# Altium schematic sheet Reference Schematic_2021-02-26.schdoc
size 1412 x 569 mm
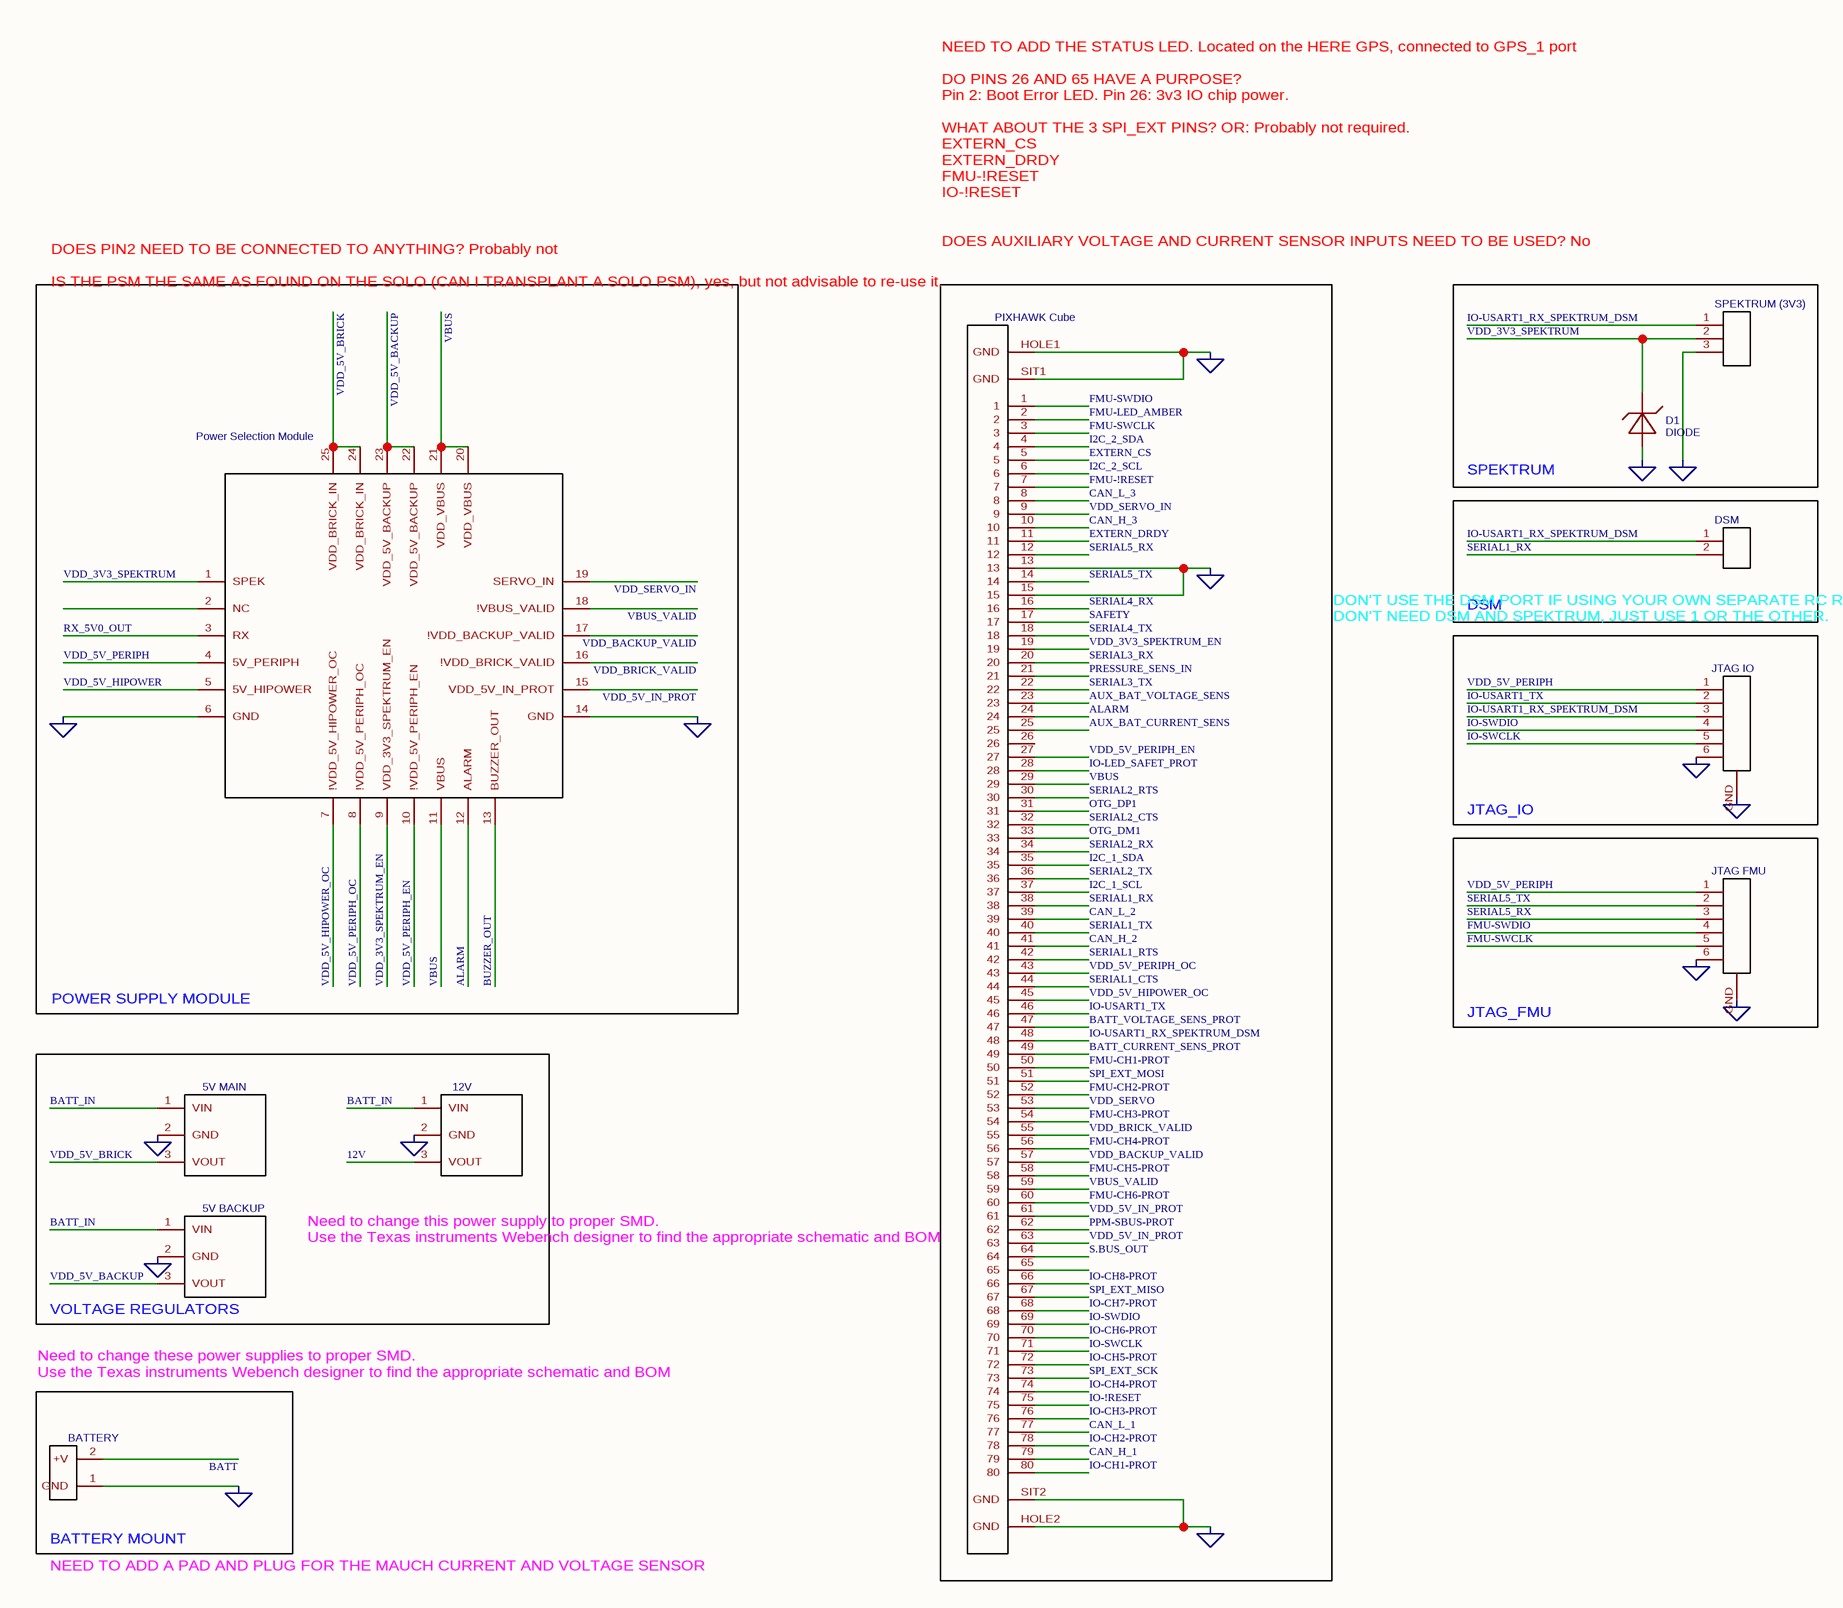
[diagram p0: Reference Schematic_2021-02-26.schdoc, top left]
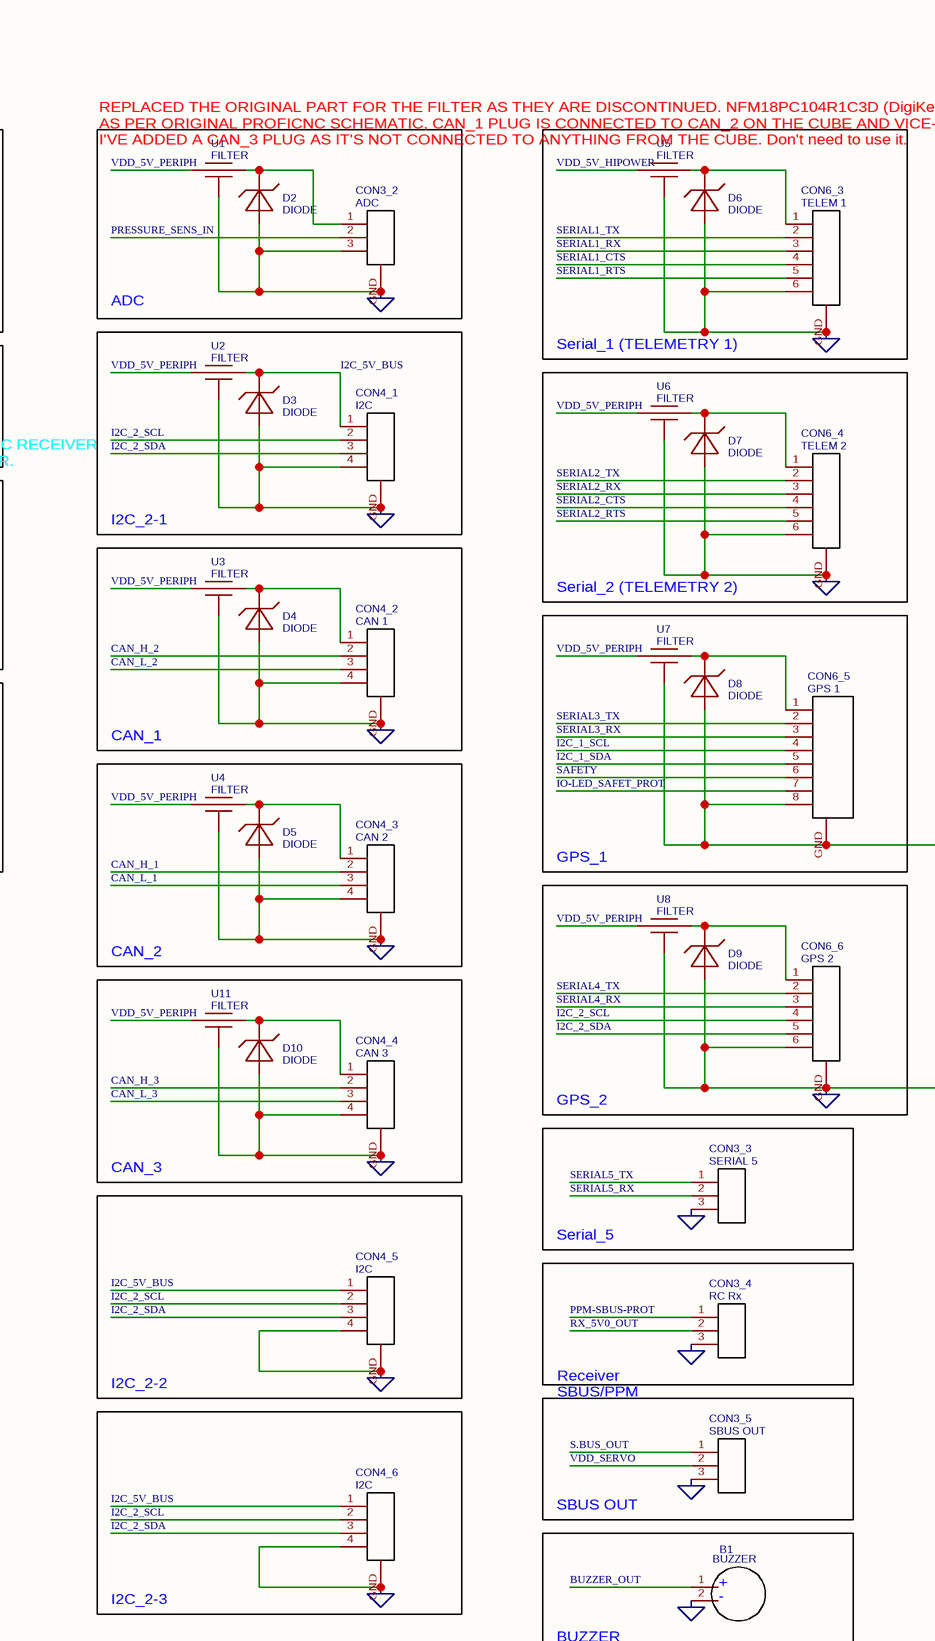
[diagram p1: Reference Schematic_2021-02-26.schdoc, top middle]
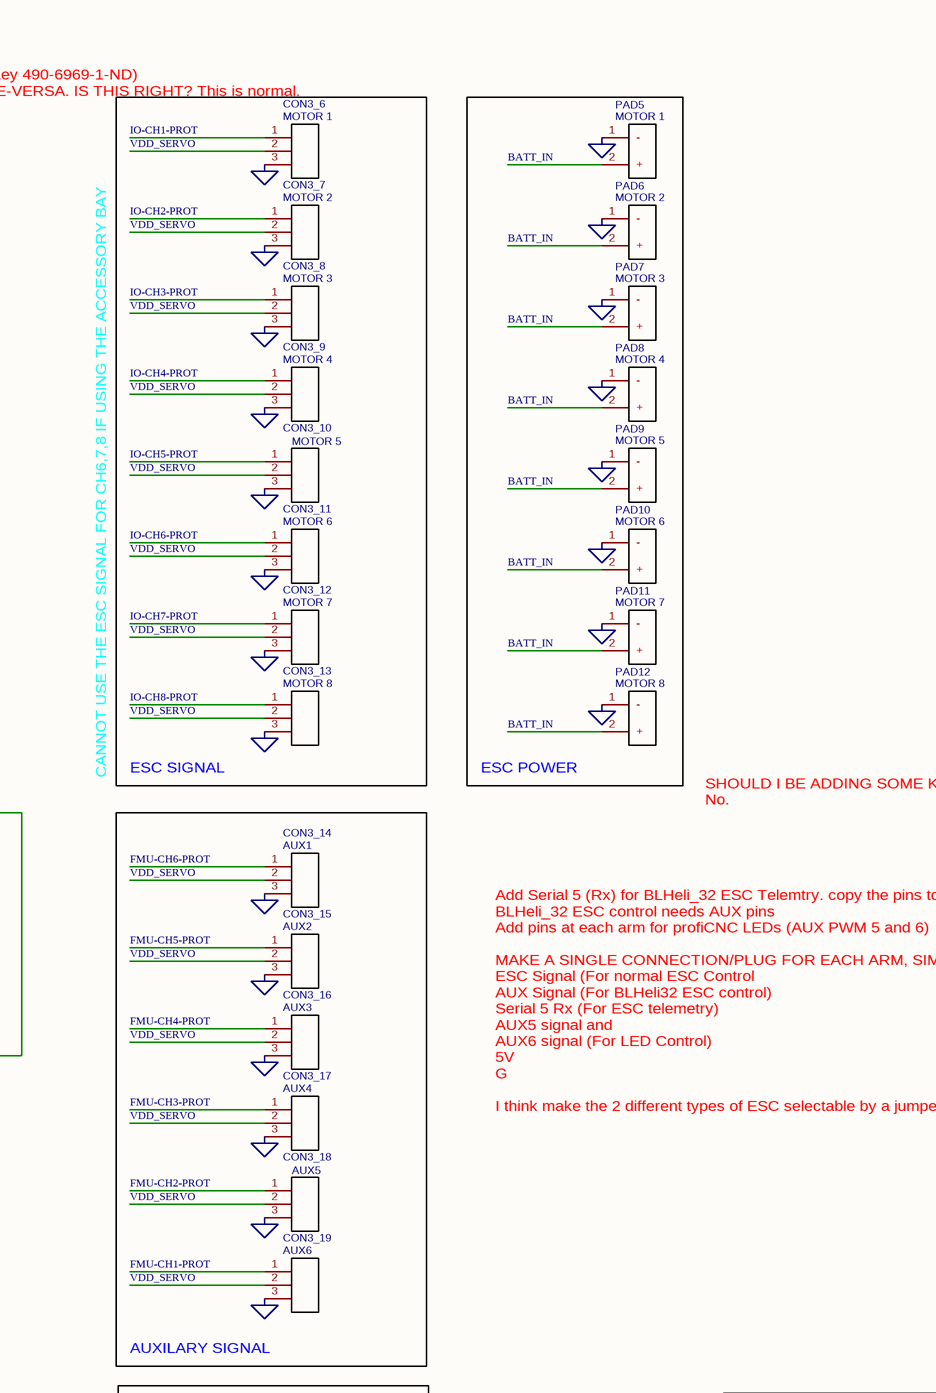
[diagram p2: Reference Schematic_2021-02-26.schdoc, top right]
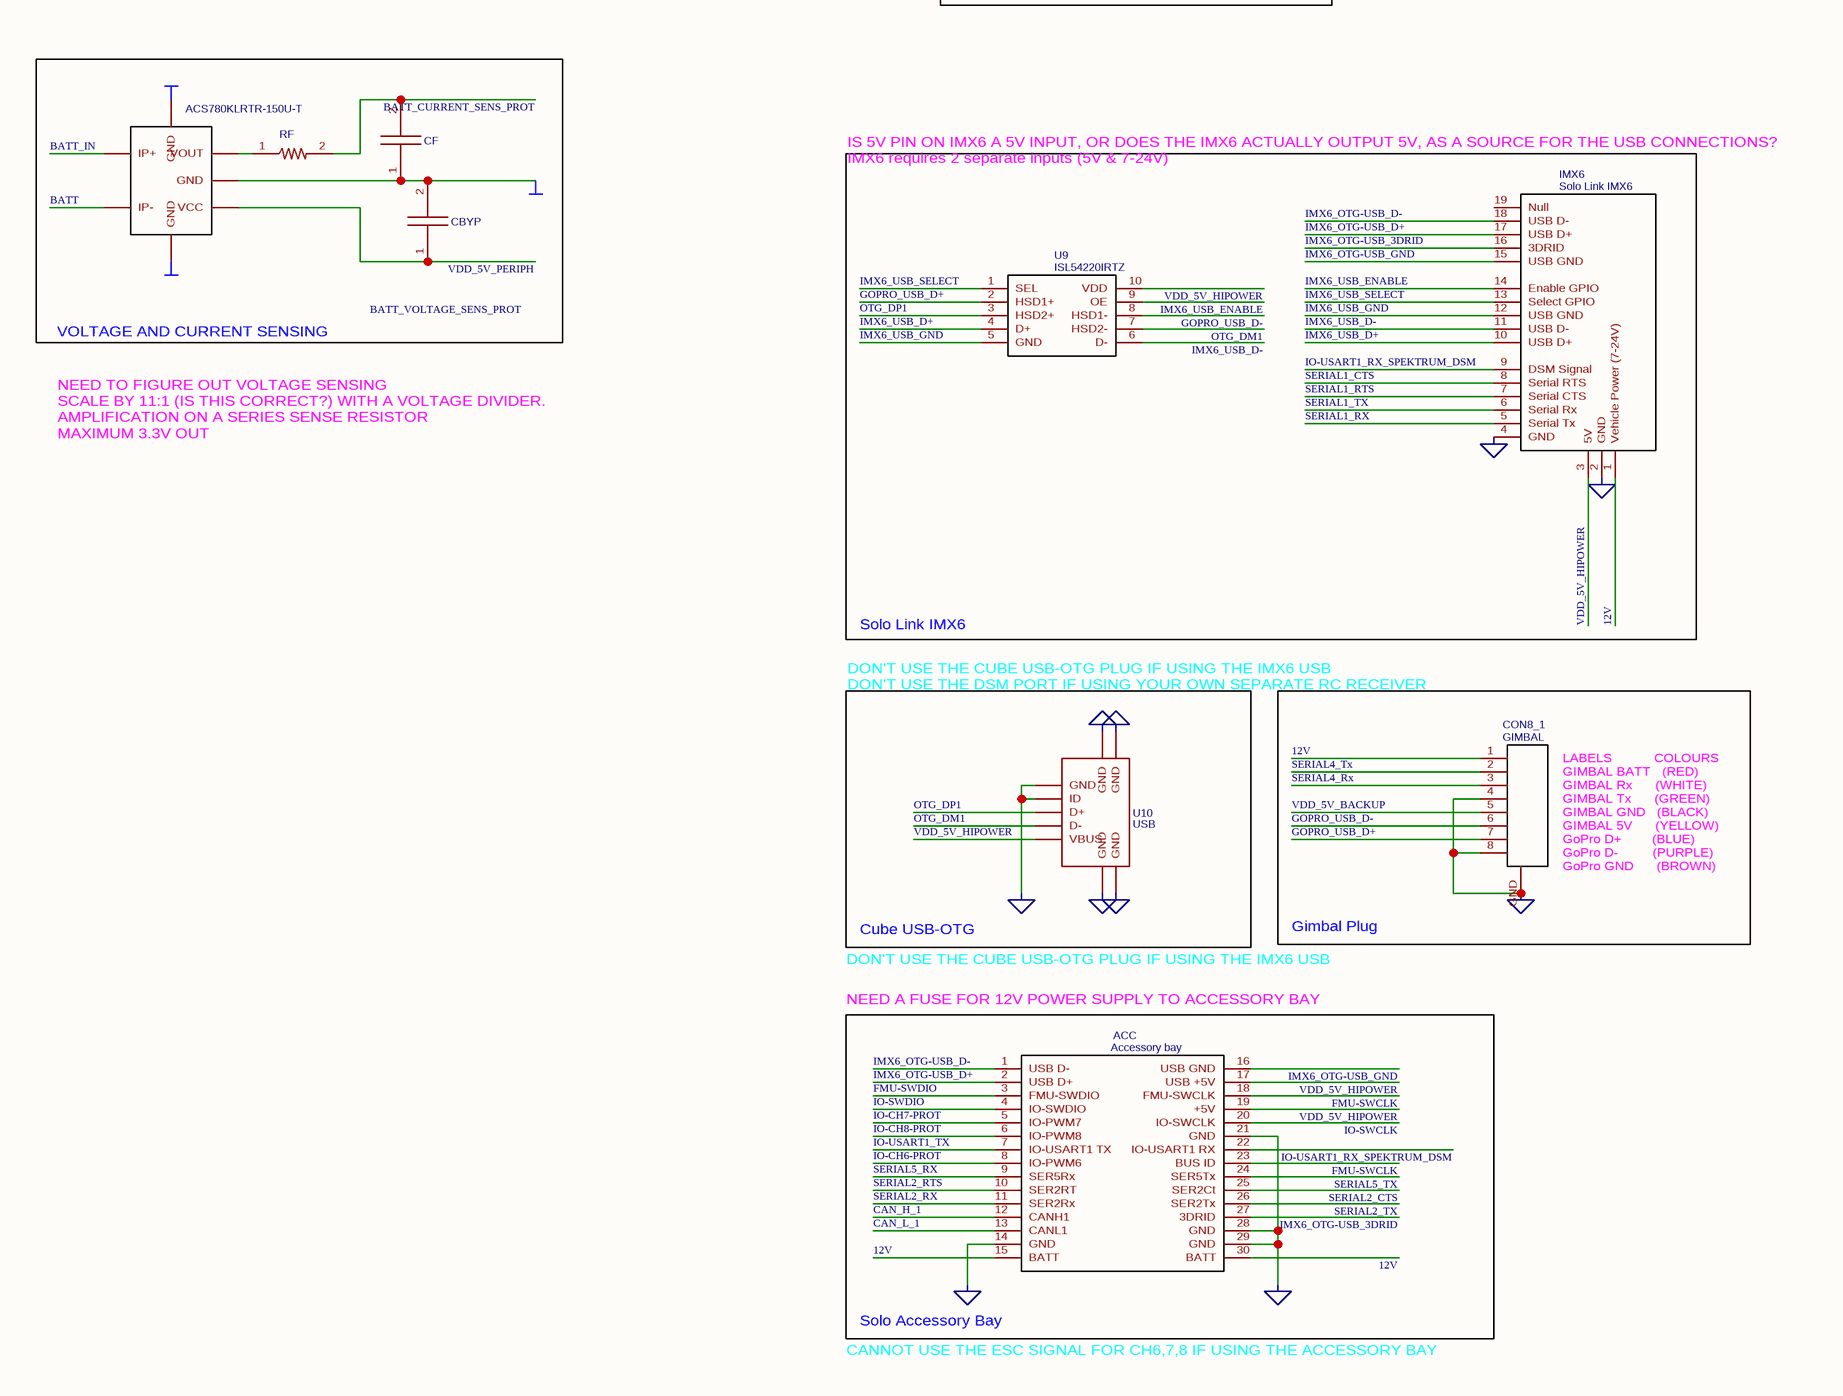
[diagram p3: Reference Schematic_2021-02-26.schdoc, bottom left]
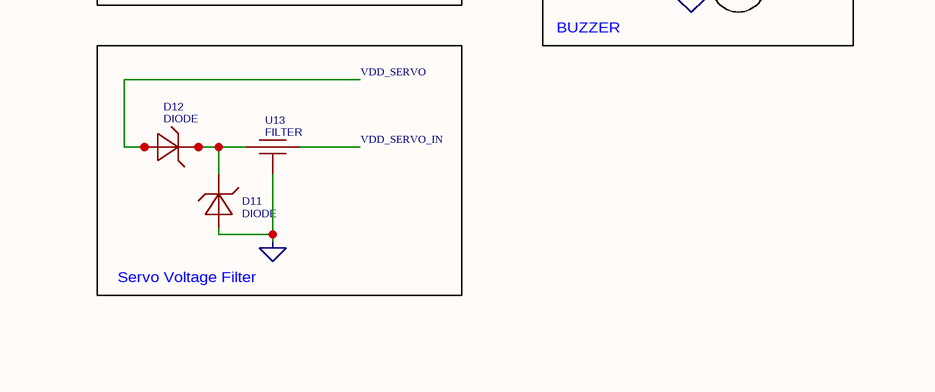
[diagram p4: Reference Schematic_2021-02-26.schdoc, bottom middle]
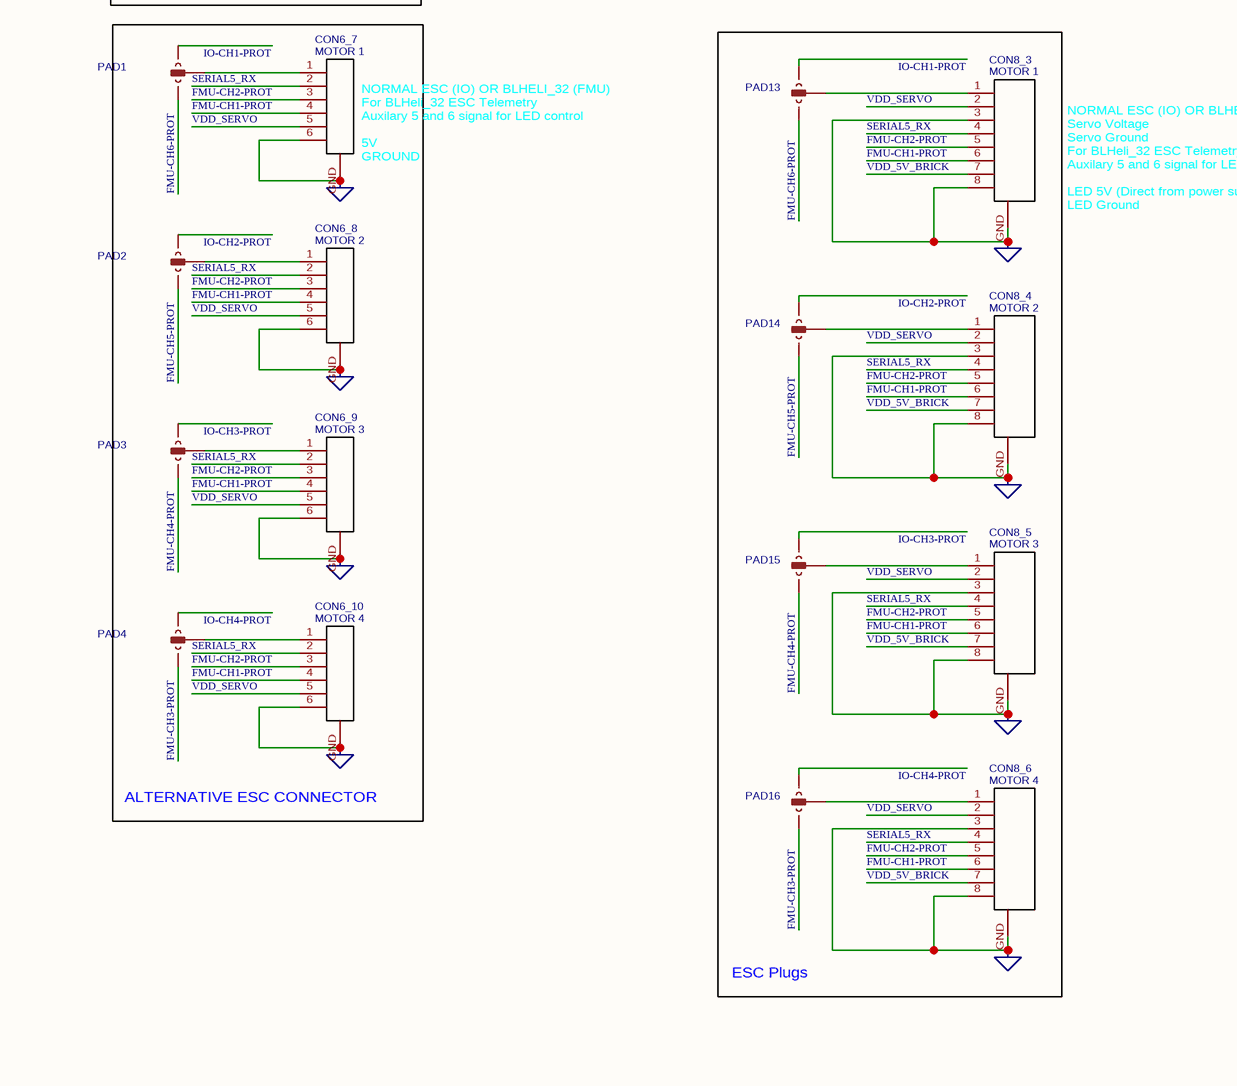
[diagram p5: Reference Schematic_2021-02-26.schdoc, bottom right]

## Parts
5V_1  5V MAIN  [D24V50F5]
5V_2  5V BACKUP  [D24V50F5]
12V_1  12V  [D24V22F12]
ACC  Accessory bay  [ACCESSORY BAY]
B1  BUZZER  [AT-2460-TWT-R]
BATTERY_PAD  BATTERY  [XT60 PANEL MOUNT]
CBYP  Capacitor  [NONE]  (value not drawn)
CF  Capacitor  [NONE]  (value not drawn)
CON2_1  DSM  [2X1 THROUGH HOLE HEADER]
CON3_1  SPEKTRUM (3V3)  [3X1 THROUGH HOLE HEADER]
CON3_2  ADC  [BM03B-GHS-TBT]
CON3_3  SERIAL 5  [3X1 THROUGH HOLE HEADER]
CON3_4  RC Rx  [3X1 SERVO HEADER]
CON3_5  SBUS OUT  [3X1 SERVO HEADER]
CON3_6  MOTOR 1  [3X1 SERVO HEADER]
CON3_7  MOTOR 2  [3X1 SERVO HEADER]
CON3_8  MOTOR 3  [3X1 SERVO HEADER]
CON3_9  MOTOR 4  [3X1 SERVO HEADER]
CON3_10  MOTOR 5  [3X1 SERVO HEADER]
CON3_11  MOTOR 6  [3X1 SERVO HEADER]
CON3_12  MOTOR 7  [3X1 SERVO HEADER]
CON3_13  MOTOR 8  [3X1 SERVO HEADER]
CON3_14  AUX1  [3X1 THROUGH HOLE HEADER]
CON3_15  AUX2  [3X1 THROUGH HOLE HEADER]
CON3_16  AUX3  [3X1 THROUGH HOLE HEADER]
CON3_17  AUX4  [3X1 THROUGH HOLE HEADER]
CON3_18  AUX5  [3X1 THROUGH HOLE HEADER]
CON3_19  AUX6  [3X1 THROUGH HOLE HEADER]
CON4_1  I2C  [BM04B-GHS-TBT]
CON4_2  CAN 1  [BM04B-GHS-TBT]
CON4_3  CAN 2  [BM04B-GHS-TBT]
CON4_4  CAN 3  [BM04B-GHS-TBT]
CON4_5  I2C  [BM04B-GHS-TBT]
CON4_6  I2C  [BM04B-GHS-TBT]
CON6_1  JTAG IO  [SM06B-SURS-TF]
CON6_2  JTAG FMU  [SM06B-SURS-TF]
CON6_3  TELEM 1  [BM06B-GHS-TBT]
CON6_4  TELEM 2  [BM06B-GHS-TBT]
CON6_5  GPS 1  [BM08B-GHS-TBT]
CON6_6  GPS 2  [BM06B-GHS-TBT]
CON6_7  MOTOR 1  [BM06B-GHS-TBT (FOR MOTOR MOUNTS)]
CON6_8  MOTOR 2  [BM06B-GHS-TBT (FOR MOTOR MOUNTS)]
CON6_9  MOTOR 3  [BM06B-GHS-TBT (FOR MOTOR MOUNTS)]
CON6_10  MOTOR 4  [BM06B-GHS-TBT (FOR MOTOR MOUNTS)]
CON8_1  GIMBAL  [BM08B-GHS-TBT]
CON8_3  MOTOR 1  [BM08B-GHS-TBT (FOR MOTOR MOUNTS)]
CON8_4  MOTOR 2  [BM08B-GHS-TBT (FOR MOTOR MOUNTS)]
CON8_5  MOTOR 3  [BM08B-GHS-TBT (FOR MOTOR MOUNTS)]
CON8_6  MOTOR 4  [BM08B-GHS-TBT (FOR MOTOR MOUNTS)]
D1  DIODE  [0402 DIODE]
D2  DIODE  [0402 DIODE]
D3  DIODE  [0402 DIODE]
D4  DIODE  [0402 DIODE]
D5  DIODE  [0402 DIODE]
D6  DIODE  [0402 DIODE]
D7  DIODE  [0402 DIODE]
D8  DIODE  [0402 DIODE]
D9  DIODE  [0402 DIODE]
D10  DIODE  [0402 DIODE]
D11  DIODE  [0402 DIODE]
D12  DIODE  [MSS1P4-M3/89A DIODE]
DF17(1.0H)-80DP-0.5V(57)  PIXHAWK Cube  [CON-DF17-80M]
IMX6  Solo Link IMX6  [SOLO LINK IMX6]
PAD1  ESC Select  [SOLDER JUMPER (ESC - BLHELI)]  (value not drawn)
PAD2  ESC Select  [SOLDER JUMPER (ESC - BLHELI)]  (value not drawn)
PAD3  ESC Select  [SOLDER JUMPER (ESC - BLHELI)]  (value not drawn)
PAD4  ESC Select  [SOLDER JUMPER (ESC - BLHELI)]  (value not drawn)
PAD5  MOTOR 1  [MOTOR PAD]
PAD6  MOTOR 2  [MOTOR PAD]
PAD7  MOTOR 3  [MOTOR PAD]
PAD8  MOTOR 4  [MOTOR PAD]
PAD9  MOTOR 5  [MOTOR PAD]
PAD10  MOTOR 6  [MOTOR PAD]
PAD11  MOTOR 7  [MOTOR PAD]
PAD12  MOTOR 8  [MOTOR PAD]
PAD13  ESC Select  [SOLDER JUMPER (ESC - BLHELI)]  (value not drawn)
PAD14  ESC Select  [SOLDER JUMPER (ESC - BLHELI)]  (value not drawn)
PAD15  ESC Select  [SOLDER JUMPER (ESC - BLHELI)]  (value not drawn)
PAD16  ESC Select  [SOLDER JUMPER (ESC - BLHELI)]  (value not drawn)
PSM  Power Selection Module  [POWER SELECTION MODULE]
RF  Resistor  [NONE]  (value not drawn)
U1  FILTER  [0603 LC EMI FILTER]
U2  FILTER  [0603 LC EMI FILTER]
U3  FILTER  [0603 LC EMI FILTER]
U4  FILTER  [0603 LC EMI FILTER]
U5  FILTER  [0603 LC EMI FILTER]
U6  FILTER  [0603 LC EMI FILTER]
U7  FILTER  [0603 LC EMI FILTER]
U8  FILTER  [0603 LC EMI FILTER]
U9  ISL54220IRTZ  [ISL54220IRTZ]
U10  USB  [10118194-0001LF]
U11  FILTER  [0603 LC EMI FILTER]
U12  ACS780KLRTR-150U-T  [ACS780KLRTR-150U-T]
U13  FILTER  [0603 LC EMI FILTER]

## Blocks framed on the sheet
POWER SUPPLY MODULE: PSM
SPEKTRUM: CON3_1 D1
ADC: CON3_2 D2 U1
Serial_1 (TELEMETRY 1): CON6_3 D6 U5
ESC SIGNAL: CON3_6-CON3_13
ESC POWER: PAD5-PAD12
DSM: CON2_1
I2C_2-1: CON4_1 D3 U2
Serial_2 (TELEMETRY 2): CON6_4 D7 U6
JTAG_IO: CON6_1
CAN_1: CON4_2 D4 U3
GPS_1: CON6_5 D8 U7
JTAG_FMU: CON6_2
CAN_2: CON4_3 D5 U4
AUXILARY SIGNAL: CON3_14-CON3_19
VOLTAGE REGULATORS: 5V_1 5V_2 12V_1
GPS_2: CON6_6 D9 U8
CAN_3: CON4_4 D10 U11
Serial_5: CON3_3
BATTERY MOUNT: BATTERY_PAD
I2C_2-2: CON4_5
SBUS OUT: CON3_5
I2C_2-3: CON4_6
ALTERNATIVE ESC CONNECTOR: CON6_7-CON6_10 PAD1-PAD4
ESC Plugs: CON8_3-CON8_6 PAD13-PAD16
VOLTAGE AND CURRENT SENSING: CBYP CF RF U12
BUZZER: B1
Solo Link IMX6: IMX6 U9
Servo Voltage Filter: D11 D12 U13
Cube USB-OTG: U10
Gimbal Plug: CON8_1

## Nets
GND: 5V_1.2(GND) 5V_2.2(GND) 12V_1.2(GND) ACC.14(GND) ACC.21(GND) ACC.28(GND) ACC.29(GND) B1.2 BATTERY_PAD.1(GND) CBYP.2 CF.1 CON3_1.3 CON3_2.3 CON3_2.GND CON3_3.3 CON3_4.3 CON3_5.3 CON3_6.3 CON3_7.3 CON3_8.3 CON3_9.3 CON3_10.3 CON3_11.3 CON3_12.3 CON3_13.3 CON3_14.3 CON3_15.3 CON3_16.3 CON3_17.3 CON3_18.3 CON3_19.3 CON4_1.4 CON4_1.GND CON4_2.4 CON4_2.GND CON4_3.4 CON4_3.GND CON4_4.4 CON4_4.GND CON4_5.4 CON4_5.GND CON4_6.4 CON4_6.GND CON6_1.6 CON6_1.GND CON6_2.6 CON6_2.GND CON6_3.6 CON6_3.GND CON6_4.6 CON6_4.GND CON6_5.8 CON6_5.GND CON6_6.6 CON6_6.GND CON6_7.6 CON6_7.GND CON6_8.6 CON6_8.GND CON6_9.6 CON6_9.GND CON6_10.6 CON6_10.GND CON8_1.4 CON8_1.8 CON8_1.GND CON8_3.3 CON8_3.8 CON8_3.GND CON8_4.3 CON8_4.8 CON8_4.GND CON8_5.3 CON8_5.8 CON8_5.GND CON8_6.3 CON8_6.8 CON8_6.GND D1.2 D2.2 D3.2 D4.2 D5.2 D6.2 D7.2 D8.2 D9.2 D10.2 D11.2 DF17(1.0H)-80DP-0.5V(57).13 DF17(1.0H)-80DP-0.5V(57).15 DF17(1.0H)-80DP-0.5V(57).HOLE1(GND) DF17(1.0H)-80DP-0.5V(57).HOLE2(GND) DF17(1.0H)-80DP-0.5V(57).SIT1(GND) DF17(1.0H)-80DP-0.5V(57).SIT2(GND) IMX6.2(GND) IMX6.4(GND) PAD5.1(-) PAD6.1(-) PAD7.1(-) PAD8.1(-) PAD9.1(-) PAD10.1(-) PAD11.1(-) PAD12.1(-) PSM.6(GND) PSM.14(GND) U1.GND U2.GND U3.GND U4.GND U5.GND U6.GND U7.GND U8.GND U10.4(ID) U10.5(GND) U10.GND U11.GND U12.2(GND) U12.4(GND) U12.7(GND) U13.GND
12V: 12V_1.3(VOUT) ACC.15(BATT) ACC.30(BATT) CON8_1.1 IMX6.1(Vehicle_Power_(7-24V))
ALARM: DF17(1.0H)-80DP-0.5V(57).24 PSM.12(ALARM)
AUX_BAT_CURRENT_SENS: DF17(1.0H)-80DP-0.5V(57).25
AUX_BAT_VOLTAGE_SENS: DF17(1.0H)-80DP-0.5V(57).23
BATT: BATTERY_PAD.2(+V) U12.6(IP-)
BATT_CURRENT_SENS_PROT: CF.2 DF17(1.0H)-80DP-0.5V(57).49 RF.2
BATT_IN: 5V_1.1(VIN) 5V_2.1(VIN) 12V_1.1(VIN) PAD5.2(+) PAD6.2(+) PAD7.2(+) PAD8.2(+) PAD9.2(+) PAD10.2(+) PAD11.2(+) PAD12.2(+) U12.5(IP+)
BATT_VOLTAGE_SENS_PROT: DF17(1.0H)-80DP-0.5V(57).47
BUZZER_OUT: B1.1 PSM.13(BUZZER_OUT)
CAN_H_1: ACC.12(CANH1) CON4_3.2 DF17(1.0H)-80DP-0.5V(57).79
CAN_H_2: CON4_2.2 DF17(1.0H)-80DP-0.5V(57).41
CAN_H_3: CON4_4.2 DF17(1.0H)-80DP-0.5V(57).10
CAN_L_1: ACC.13(CANL1) CON4_3.3 DF17(1.0H)-80DP-0.5V(57).77
CAN_L_2: CON4_2.3 DF17(1.0H)-80DP-0.5V(57).39
CAN_L_3: CON4_4.3 DF17(1.0H)-80DP-0.5V(57).8
EXTERN_CS: DF17(1.0H)-80DP-0.5V(57).5
EXTERN_DRDY: DF17(1.0H)-80DP-0.5V(57).11
FMU-!RESET: DF17(1.0H)-80DP-0.5V(57).7
FMU-CH1-PROT: CON3_19.1 CON6_7.4 CON6_8.4 CON6_9.4 CON6_10.4 CON8_3.6 CON8_4.6 CON8_5.6 CON8_6.6 DF17(1.0H)-80DP-0.5V(57).50
FMU-CH2-PROT: CON3_18.1 CON6_7.3 CON6_8.3 CON6_9.3 CON6_10.3 CON8_3.5 CON8_4.5 CON8_5.5 CON8_6.5 DF17(1.0H)-80DP-0.5V(57).52
FMU-CH3-PROT: CON3_17.1 DF17(1.0H)-80DP-0.5V(57).54 PAD4.3 PAD16.3
FMU-CH4-PROT: CON3_16.1 DF17(1.0H)-80DP-0.5V(57).56 PAD3.3 PAD15.3
FMU-CH5-PROT: CON3_15.1 DF17(1.0H)-80DP-0.5V(57).58 PAD2.3 PAD14.3
FMU-CH6-PROT: CON3_14.1 DF17(1.0H)-80DP-0.5V(57).60 PAD1.3 PAD13.3
FMU-LED_AMBER: DF17(1.0H)-80DP-0.5V(57).2
FMU-SWCLK: ACC.18(FMU-SWCLK) ACC.23(BUS_ID) CON6_2.5 DF17(1.0H)-80DP-0.5V(57).3
FMU-SWDIO: ACC.3(FMU-SWDIO) CON6_2.4 DF17(1.0H)-80DP-0.5V(57).1
GOPRO_USB_D+: CON8_1.7 U9.2(HSD1+)
GOPRO_USB_D-: CON8_1.6 U9.8(HSD1-)
I2C_1_SCL: CON6_5.4 DF17(1.0H)-80DP-0.5V(57).37
I2C_1_SDA: CON6_5.5 DF17(1.0H)-80DP-0.5V(57).35
I2C_2_SCL: CON4_1.2 CON4_5.2 CON4_6.2 CON6_6.4 DF17(1.0H)-80DP-0.5V(57).6
I2C_2_SDA: CON4_1.3 CON4_5.3 CON4_6.3 CON6_6.5 DF17(1.0H)-80DP-0.5V(57).4
I2C_5V_BUS: CON4_1.1 CON4_5.1 CON4_6.1 D3.1 U2.2
IMX6_OTG-USB_3DRID: ACC.27(3DRID) IMX6.16(3DRID)
IMX6_OTG-USB_D+: ACC.2(USB_D+) IMX6.17(USB_D+)
IMX6_OTG-USB_D-: ACC.1(USB_D-) IMX6.18(USB_D-)
IMX6_OTG-USB_GND: ACC.16(USB_GND) IMX6.15(USB_GND)
IMX6_USB_D+: IMX6.10(USB_D+) U9.4(D+)
IMX6_USB_D-: IMX6.11(USB_D-) U9.6(D-)
IMX6_USB_ENABLE: IMX6.14(Enable_GPIO) U9.9(OE)
IMX6_USB_GND: IMX6.12(USB_GND) U9.5(GND)
IMX6_USB_SELECT: IMX6.13(Select_GPIO) U9.1(SEL)
IO-!RESET: DF17(1.0H)-80DP-0.5V(57).75
IO-CH1-PROT: CON3_6.1 DF17(1.0H)-80DP-0.5V(57).80 PAD1.1 PAD13.1
IO-CH2-PROT: CON3_7.1 DF17(1.0H)-80DP-0.5V(57).78 PAD2.1 PAD14.1
IO-CH3-PROT: CON3_8.1 DF17(1.0H)-80DP-0.5V(57).76 PAD3.1 PAD15.1
IO-CH4-PROT: CON3_9.1 DF17(1.0H)-80DP-0.5V(57).74 PAD4.1 PAD16.1
IO-CH5-PROT: CON3_10.1 DF17(1.0H)-80DP-0.5V(57).72
IO-CH6-PROT: ACC.8(IO-PWM6) CON3_11.1 DF17(1.0H)-80DP-0.5V(57).70
IO-CH7-PROT: ACC.5(IO-PWM7) CON3_12.1 DF17(1.0H)-80DP-0.5V(57).68
IO-CH8-PROT: ACC.6(IO-PWM8) CON3_13.1 DF17(1.0H)-80DP-0.5V(57).66
IO-LED_SAFET_PROT: CON6_5.7 DF17(1.0H)-80DP-0.5V(57).28
IO-SWCLK: ACC.20(IO-SWCLK) CON6_1.5 DF17(1.0H)-80DP-0.5V(57).71
IO-SWDIO: ACC.4(IO-SWDIO) CON6_1.4 DF17(1.0H)-80DP-0.5V(57).69
IO-USART1_RX_SPEKTRUM_DSM: ACC.22(IO-USART1_RX) CON2_1.1 CON3_1.1 CON6_1.3 DF17(1.0H)-80DP-0.5V(57).48 IMX6.9(DSM_Signal)
IO-USART1_TX: ACC.7(IO-USART1_TX) CON6_1.2 DF17(1.0H)-80DP-0.5V(57).46
OTG_DM1: DF17(1.0H)-80DP-0.5V(57).33 U9.7(HSD2-) U10.2(D-)
OTG_DP1: DF17(1.0H)-80DP-0.5V(57).31 U9.3(HSD2+) U10.3(D+)
PPM-SBUS-PROT: CON3_4.1 DF17(1.0H)-80DP-0.5V(57).62
PRESSURE_SENS_IN: CON3_2.2 DF17(1.0H)-80DP-0.5V(57).21
RX_5V0_OUT: CON3_4.2 PSM.3(RX)
S.BUS_OUT: CON3_5.1 DF17(1.0H)-80DP-0.5V(57).64
SAFETY: CON6_5.6 DF17(1.0H)-80DP-0.5V(57).17
SERIAL1_CTS: CON6_3.4 DF17(1.0H)-80DP-0.5V(57).44 IMX6.8(Serial_RTS)
SERIAL1_RTS: CON6_3.5 DF17(1.0H)-80DP-0.5V(57).42 IMX6.7(Serial_CTS)
SERIAL1_RX: CON2_1.2 CON6_3.3 DF17(1.0H)-80DP-0.5V(57).38 IMX6.5(Serial_Tx)
SERIAL1_TX: CON6_3.2 DF17(1.0H)-80DP-0.5V(57).40 IMX6.6(Serial_Rx)
SERIAL2_CTS: ACC.25(SER2Ct) CON6_4.4 DF17(1.0H)-80DP-0.5V(57).32
SERIAL2_RTS: ACC.10(SER2RT) CON6_4.5 DF17(1.0H)-80DP-0.5V(57).30
SERIAL2_RX: ACC.11(SER2Rx) CON6_4.3 DF17(1.0H)-80DP-0.5V(57).34
SERIAL2_TX: ACC.26(SER2Tx) CON6_4.2 DF17(1.0H)-80DP-0.5V(57).36
SERIAL3_RX: CON6_5.3 DF17(1.0H)-80DP-0.5V(57).20
SERIAL3_TX: CON6_5.2 DF17(1.0H)-80DP-0.5V(57).22
SERIAL4_RX: CON6_6.3 CON8_1.3 DF17(1.0H)-80DP-0.5V(57).16
SERIAL4_TX: CON6_6.2 CON8_1.2 DF17(1.0H)-80DP-0.5V(57).18
SERIAL5_RX: ACC.9(SER5Rx) CON3_3.2 CON6_2.3 CON6_7.2 CON6_8.2 CON6_9.2 CON6_10.2 CON8_3.4 CON8_4.4 CON8_5.4 CON8_6.4 DF17(1.0H)-80DP-0.5V(57).12
SERIAL5_TX: ACC.24(SER5Tx) CON3_3.1 CON6_2.2 DF17(1.0H)-80DP-0.5V(57).14
SPI_EXT_MISO: DF17(1.0H)-80DP-0.5V(57).67
SPI_EXT_MOSI: DF17(1.0H)-80DP-0.5V(57).51
SPI_EXT_SCK: DF17(1.0H)-80DP-0.5V(57).73
VBUS: DF17(1.0H)-80DP-0.5V(57).29 PSM.11(VBUS) PSM.20(VDD_VBUS) PSM.21(VDD_VBUS)
VBUS_VALID: DF17(1.0H)-80DP-0.5V(57).59 PSM.18(!VBUS_VALID)
VDD_3V3_SPEKTRUM: CON3_1.2 D1.1 PSM.1(SPEK)
VDD_3V3_SPEKTRUM_EN: DF17(1.0H)-80DP-0.5V(57).19 PSM.9(VDD_3V3_SPEKTRUM_EN)
VDD_5V_BACKUP: 5V_2.3(VOUT) CON8_1.5 PSM.22(VDD_5V_BACKUP) PSM.23(VDD_5V_BACKUP)
VDD_5V_BRICK: 5V_1.3(VOUT) CON8_3.7 CON8_4.7 CON8_5.7 CON8_6.7 PSM.24(VDD_BRICK_IN) PSM.25(VDD_BRICK_IN)
VDD_5V_HIPOWER: ACC.17(USB_+5V) ACC.19(+5V) IMX6.3(5V) PSM.5(5V_HIPOWER) U5.1 U9.10(VDD) U10.1(VBUS)
VDD_5V_HIPOWER_OC: DF17(1.0H)-80DP-0.5V(57).45 PSM.7(!VDD_5V_HIPOWER_OC)
VDD_5V_IN_PROT: DF17(1.0H)-80DP-0.5V(57).61 DF17(1.0H)-80DP-0.5V(57).63 PSM.15(VDD_5V_IN_PROT)
VDD_5V_PERIPH: CBYP.1 CON6_1.1 CON6_2.1 PSM.4(5V_PERIPH) U1.1 U2.1 U3.1 U4.1 U6.1 U7.1 U8.1 U11.1 U12.1(VCC)
VDD_5V_PERIPH_EN: DF17(1.0H)-80DP-0.5V(57).27 PSM.10(!VDD_5V_PERIPH_EN)
VDD_5V_PERIPH_OC: DF17(1.0H)-80DP-0.5V(57).43 PSM.8(!VDD_5V_PERIPH_OC)
VDD_BACKUP_VALID: DF17(1.0H)-80DP-0.5V(57).57 PSM.17(!VDD_BACKUP_VALID)
VDD_BRICK_VALID: DF17(1.0H)-80DP-0.5V(57).55 PSM.16(!VDD_BRICK_VALID)
VDD_SERVO: CON3_5.2 CON3_6.2 CON3_7.2 CON3_8.2 CON3_9.2 CON3_10.2 CON3_11.2 CON3_12.2 CON3_13.2 CON3_14.2 CON3_15.2 CON3_16.2 CON3_17.2 CON3_18.2 CON3_19.2 CON6_7.5 CON6_8.5 CON6_9.5 CON6_10.5 CON8_3.2 CON8_4.2 CON8_5.2 CON8_6.2 D12.2 DF17(1.0H)-80DP-0.5V(57).53
VDD_SERVO_IN: DF17(1.0H)-80DP-0.5V(57).9 PSM.19(SERVO_IN) U13.2
NetCON3_2_1: CON3_2.1 D2.1 U1.2
NetCON4_2_1: CON4_2.1 D4.1 U3.2
NetCON4_3_1: CON4_3.1 D5.1 U4.2
NetCON4_4_1: CON4_4.1 D10.1 U11.2
NetCON6_3_1: CON6_3.1 D6.1 U5.2
NetCON6_4_1: CON6_4.1 D7.1 U6.2
NetCON6_5_1: CON6_5.1 D8.1 U7.2
NetCON6_6_1: CON6_6.1 D9.1 U8.2
NetCON6_7_1: CON6_7.1 PAD1.2
NetCON6_8_1: CON6_8.1 PAD2.2
NetCON6_9_1: CON6_9.1 PAD3.2
NetCON6_10_1: CON6_10.1 PAD4.2
NetCON8_3_1: CON8_3.1 PAD13.2
NetCON8_4_1: CON8_4.1 PAD14.2
NetCON8_5_1: CON8_5.1 PAD15.2
NetCON8_6_1: CON8_6.1 PAD16.2
NetD11_1: D11.1 D12.1 U13.1
NetRF_1: RF.1 U12.3(VOUT)

Not connected (* = marked no-connect by the designer): DF17(1.0H)-80DP-0.5V(57) 26 65; IMX6 19(Null); PSM 2(NC)

## Notes on the sheet
- NEED TO ADD THE STATUS LED. Located on the HERE GPS, connected to GPS_1 port
  DO PINS 26 AND 65 HAVE A PURPOSE?
  Pin 2: Boot Error LED. Pin 26: 3v3 IO chip power.
  WHAT ABOUT THE 3 SPI_EXT PINS? OR: Probably not required.
  EXTERN_CS
  EXTERN_DRDY
  FMU-!RESET
  IO-!RESET
  DOES AUXILIARY VOLTAGE AND CURRENT SENSOR INPUTS NEED TO BE USED? No
- DOES PIN2 NEED TO BE CONNECTED TO ANYTHING? Probably not
  IS THE PSM THE SAME AS FOUND ON THE SOLO (CAN I TRANSPLANT A SOLO PSM), yes, but not advisable to re-use it.
- (near U1) REPLACED THE ORIGINAL PART FOR THE FILTER AS THEY ARE DISCONTINUED. NFM18PC104R1C3D (DigiKey 490-6969-1-ND)
  AS PER ORIGINAL PROFICNC SCHEMATIC, CAN_1 PLUG IS CONNECTED TO CAN_2 ON THE CUBE AND VICE-VERSA. IS THIS RIGHT? This is normal.
  I'VE ADDED A CAN_3 PLUG AS IT'S NOT CONNECTED TO ANYTHING FROM THE CUBE. Don't need to use it.
- DON'T USE THE DSM PORT IF USING YOUR OWN SEPARATE RC RECEIVER
  DON'T NEED DSM AND SPEKTRUM, JUST USE 1 OR THE OTHER.
- CANNOT USE THE ESC SIGNAL FOR CH6,7,8 IF USING THE ACCESSORY BAY
- SHOULD I BE ADDING SOME KIND OF FILTER TO THE ESC SOLDER PADS?
  No.
- Add Serial 5 (Rx) for BLHeli_32 ESC Telemtry. copy the pins to each arm.
  BLHeli_32 ESC control needs AUX pins
  Add pins at each arm for profiCNC LEDs (AUX PWM 5 and 6)
  MAKE A SINGLE CONNECTION/PLUG FOR EACH ARM, SIMILAR TO THE WAY SOLO DOES IT. INCLUDE:
  ESC Signal (For normal ESC Control
  AUX Signal (For BLHeli32 ESC control)
  Serial 5 Rx (For ESC telemetry)
  AUX5 signal and
  AUX6 signal (For LED Control)
  5V
  G
  I think make the 2 different types of ESC selectable by a jumper, right near the plug
- (near 12V_1) Need to change this power supply to proper SMD.
  Use the Texas instruments Webench designer to find the appropriate schematic and BOM
- (near BATTERY_PAD) Need to change these power supplies to proper SMD.
  Use the Texas instruments Webench designer to find the appropriate schematic and BOM
- Receiver
  SBUS/PPM
- NEED TO ADD A PAD AND PLUG FOR THE MAUCH CURRENT AND VOLTAGE SENSOR
- (near CON6_7) NORMAL ESC (IO) OR BLHELI_32 (FMU)
  For BLHeli_32 ESC Telemetry
  Auxilary 5 and 6 signal for LED control
  5V
  GROUND
- NORMAL ESC (IO) OR BLHELI_32 (FMU)
  Servo Voltage
  Servo Ground
  For BLHeli_32 ESC Telemetry
  Auxilary 5 and 6 signal for LED control
  LED 5V (Direct from power supply)
  LED Ground
- (near U9) IS 5V PIN ON IMX6 A 5V INPUT, OR DOES THE IMX6 ACTUALLY OUTPUT 5V, AS A SOURCE FOR THE USB CONNECTIONS?
  IMX6 requires 2 separate inputs (5V & 7-24V)
- NEED TO FIGURE OUT VOLTAGE SENSING
  SCALE BY 11:1 (IS THIS CORRECT?) WITH A VOLTAGE DIVIDER.
  AMPLIFICATION ON A SERIES SENSE RESISTOR
  MAXIMUM 3.3V OUT
- DON'T USE THE CUBE USB-OTG PLUG IF USING THE IMX6 USB
  DON'T USE THE DSM PORT IF USING YOUR OWN SEPARATE RC RECEIVER
- (near CON8_1) LABELS           COLOURS
  GIMBAL BATT   (RED)
  GIMBAL Rx      (WHITE)
  GIMBAL Tx      (GREEN)
  GIMBAL GND   (BLACK)
  GIMBAL 5V      (YELLOW)
  GoPro D+        (BLUE)
  GoPro D-         (PURPLE)
  GoPro GND      (BROWN)
- DON'T USE THE CUBE USB-OTG PLUG IF USING THE IMX6 USB
- NEED A FUSE FOR 12V POWER SUPPLY TO ACCESSORY BAY
- Solo Accessory Bay
- Labels drawn without touching a wire or pin: BATT_VOLTAGE_SENS_PROT
- (in symbol BUZZER) +; -

## Library data of the parts
5V_1 = 5V MAIN: Contributor: geekness; BOM_Mounted: No; BOM_Manufacturer Part: D24V50F5; BOM_Supplier: Pololu; Link: https://www.pololu.com/product/2858; spicePre: U; BOM_Supplier Part: D24V50F5
5V_2 = 5V BACKUP: Contributor: geekness; BOM_Mounted: No; BOM_Manufacturer Part: D24V50F5; BOM_Supplier: Pololu; Link: https://www.pololu.com/product/2858; spicePre: U; BOM_Supplier Part: D24V50F5
12V_1 = 12V: Contributor: geekness; BOM_Mounted: No; BOM_Manufacturer Part: D24V22F12; BOM_Supplier: Pololu; Link: https://www.pololu.com/product/2855; spicePre: 1; BOM_Supplier Part: D24V22F12
ACC = Accessory bay: Contributor: geekness; BOM_Mounted: No; BOM_Manufacturer Part: ?; spicePre: A
B1 = BUZZER: Contributor: geekness; BOM_Manufacturer Part: AT-2460-TWT-R; BOM_Supplier: Digi-Key; Link: http://www.precidip.com/AppHost/9696,1/Scripts/Modules/Catalog/Default.aspx?c=73&i=444&p=167&pdf=1&dsku=892-PP-NNN-10-XXX101; spicePre: H; BOM_Supplier Part: 668-1318-ND
BATTERY_PAD = BATTERY: Contributor: geekness; BOM_Mounted: No; BOM_Manufacturer Part: XT60 Panel Mount; spicePre: U
CBYP CF = Capacitor: BOM_Manufacturer Part: New SchematicLib; Contributor: geekness; BOM_Supplier: Digi-Key; spicePre: C; BOM_Supplier Part: undefined
CON2_1 = DSM: BOM_Manufacturer Part: 892-70-012-10-001101; Contributor: geekness; BOM_Supplier: Digi-Key; Link: http://www.precidip.com/AppHost/9696,1/Scripts/Modules/Catalog/Default.aspx?c=73&i=444&p=167&pdf=1&dsku=892-PP-NNN-10-XXX101; spicePre: H; BOM_Supplier Part: 892-70-012-10-001101-ND
CON3_1 = SPEKTRUM (3V3): BOM_Manufacturer Part: 894-70-012-10-001101; Contributor: geekness; BOM_Supplier: Digi-Key; link: http://www.precidip.com/AppHost/9696,1/Scripts/Modules/Catalog/Default.aspx?c=73&i=450&p=168&pdf=1&dsku=894-PP-NNN-10-001101; spicePre: H; BOM_Supplier Part: 894-70-012-10-001101-ND
CON3_2 = ADC: BOM_Manufacturer Part: BM03B-GHS-TBT(LF)(SN)(N); catid: 20; sourceId: i5d7pHZhZ; Description: CONN HEADER GH TOP 3POS 1.25MM; timeStamp: 1458998603; BOM_Supplier: Digi-Key; Link: http://www.jst-mfg.com/product/pdf/eng/eGH.pdf; spicePre: J; BOM_Supplier Part: 455-1579-2-ND
CON3_3 = SERIAL 5: BOM_Manufacturer Part: 894-70-012-10-001101; Contributor: geekness; BOM_Mounted: No; BOM_Supplier: Digi-Key; link: http://www.precidip.com/AppHost/9696,1/Scripts/Modules/Catalog/Default.aspx?c=73&i=450&p=168&pdf=1&dsku=894-PP-NNN-10-001101; spicePre: H; BOM_Supplier Part: 894-70-012-10-001101-ND
CON3_4 = RC Rx: BOM_Manufacturer Part: 894-70-012-10-001101; Contributor: geekness; BOM_Mounted: No; BOM_Supplier: Digi-Key; link: http://www.precidip.com/AppHost/9696,1/Scripts/Modules/Catalog/Default.aspx?c=73&i=450&p=168&pdf=1&dsku=894-PP-NNN-10-001101; spicePre: H; BOM_Supplier Part: 894-70-012-10-001101-ND
CON3_5 = SBUS OUT: BOM_Manufacturer Part: 894-70-012-10-001101; Contributor: geekness; BOM_Mounted: No; BOM_Supplier: Digi-Key; link: http://www.precidip.com/AppHost/9696,1/Scripts/Modules/Catalog/Default.aspx?c=73&i=450&p=168&pdf=1&dsku=894-PP-NNN-10-001101; spicePre: H; BOM_Supplier Part: 894-70-012-10-001101-ND
CON3_6 = MOTOR 1: BOM_Manufacturer Part: 894-70-012-10-001101; Contributor: geekness; BOM_Mounted: No; BOM_Supplier: Digi-Key; link: http://www.precidip.com/AppHost/9696,1/Scripts/Modules/Catalog/Default.aspx?c=73&i=450&p=168&pdf=1&dsku=894-PP-NNN-10-001101; spicePre: H; BOM_Supplier Part: 894-70-012-10-001101-ND
CON3_7 = MOTOR 2: BOM_Manufacturer Part: 894-70-012-10-001101; Contributor: geekness; BOM_Mounted: No; BOM_Supplier: Digi-Key; link: http://www.precidip.com/AppHost/9696,1/Scripts/Modules/Catalog/Default.aspx?c=73&i=450&p=168&pdf=1&dsku=894-PP-NNN-10-001101; spicePre: H; BOM_Supplier Part: 894-70-012-10-001101-ND
CON3_8 = MOTOR 3: BOM_Manufacturer Part: 894-70-012-10-001101; Contributor: geekness; BOM_Mounted: No; BOM_Supplier: Digi-Key; link: http://www.precidip.com/AppHost/9696,1/Scripts/Modules/Catalog/Default.aspx?c=73&i=450&p=168&pdf=1&dsku=894-PP-NNN-10-001101; spicePre: H; BOM_Supplier Part: 894-70-012-10-001101-ND
CON3_9 = MOTOR 4: BOM_Manufacturer Part: 894-70-012-10-001101; Contributor: geekness; BOM_Mounted: No; BOM_Supplier: Digi-Key; link: http://www.precidip.com/AppHost/9696,1/Scripts/Modules/Catalog/Default.aspx?c=73&i=450&p=168&pdf=1&dsku=894-PP-NNN-10-001101; spicePre: H; BOM_Supplier Part: 894-70-012-10-001101-ND
CON3_10 = MOTOR 5: BOM_Manufacturer Part: 894-70-012-10-001101; Contributor: geekness; BOM_Mounted: No; BOM_Supplier: Digi-Key; link: http://www.precidip.com/AppHost/9696,1/Scripts/Modules/Catalog/Default.aspx?c=73&i=450&p=168&pdf=1&dsku=894-PP-NNN-10-001101; spicePre: H; BOM_Supplier Part: 894-70-012-10-001101-ND
CON3_11 = MOTOR 6: BOM_Manufacturer Part: 894-70-012-10-001101; Contributor: geekness; BOM_Mounted: No; BOM_Supplier: Digi-Key; link: http://www.precidip.com/AppHost/9696,1/Scripts/Modules/Catalog/Default.aspx?c=73&i=450&p=168&pdf=1&dsku=894-PP-NNN-10-001101; spicePre: H; BOM_Supplier Part: 894-70-012-10-001101-ND
CON3_12 = MOTOR 7: BOM_Manufacturer Part: 894-70-012-10-001101; Contributor: geekness; BOM_Mounted: No; BOM_Supplier: Digi-Key; link: http://www.precidip.com/AppHost/9696,1/Scripts/Modules/Catalog/Default.aspx?c=73&i=450&p=168&pdf=1&dsku=894-PP-NNN-10-001101; spicePre: H; BOM_Supplier Part: 894-70-012-10-001101-ND
CON3_13 = MOTOR 8: BOM_Manufacturer Part: 894-70-012-10-001101; Contributor: geekness; BOM_Mounted: No; BOM_Supplier: Digi-Key; link: http://www.precidip.com/AppHost/9696,1/Scripts/Modules/Catalog/Default.aspx?c=73&i=450&p=168&pdf=1&dsku=894-PP-NNN-10-001101; spicePre: H; BOM_Supplier Part: 894-70-012-10-001101-ND
CON3_14 = AUX1: BOM_Manufacturer Part: 894-70-012-10-001101; Contributor: geekness; BOM_Mounted: No; BOM_Supplier: Digi-Key; link: http://www.precidip.com/AppHost/9696,1/Scripts/Modules/Catalog/Default.aspx?c=73&i=450&p=168&pdf=1&dsku=894-PP-NNN-10-001101; spicePre: H; BOM_Supplier Part: 894-70-012-10-001101-ND
CON3_15 = AUX2: BOM_Manufacturer Part: 894-70-012-10-001101; Contributor: geekness; BOM_Mounted: No; BOM_Supplier: Digi-Key; link: http://www.precidip.com/AppHost/9696,1/Scripts/Modules/Catalog/Default.aspx?c=73&i=450&p=168&pdf=1&dsku=894-PP-NNN-10-001101; spicePre: H; BOM_Supplier Part: 894-70-012-10-001101-ND
CON3_16 = AUX3: BOM_Manufacturer Part: 894-70-012-10-001101; Contributor: geekness; BOM_Mounted: No; BOM_Supplier: Digi-Key; link: http://www.precidip.com/AppHost/9696,1/Scripts/Modules/Catalog/Default.aspx?c=73&i=450&p=168&pdf=1&dsku=894-PP-NNN-10-001101; spicePre: H; BOM_Supplier Part: 894-70-012-10-001101-ND
CON3_17 = AUX4: BOM_Manufacturer Part: 894-70-012-10-001101; Contributor: geekness; BOM_Mounted: No; BOM_Supplier: Digi-Key; link: http://www.precidip.com/AppHost/9696,1/Scripts/Modules/Catalog/Default.aspx?c=73&i=450&p=168&pdf=1&dsku=894-PP-NNN-10-001101; spicePre: H; BOM_Supplier Part: 894-70-012-10-001101-ND
CON3_18 = AUX5: BOM_Manufacturer Part: 894-70-012-10-001101; Contributor: geekness; BOM_Mounted: No; BOM_Supplier: Digi-Key; link: http://www.precidip.com/AppHost/9696,1/Scripts/Modules/Catalog/Default.aspx?c=73&i=450&p=168&pdf=1&dsku=894-PP-NNN-10-001101; spicePre: H; BOM_Supplier Part: 894-70-012-10-001101-ND
CON3_19 = AUX6: BOM_Manufacturer Part: 894-70-012-10-001101; Contributor: geekness; BOM_Mounted: No; BOM_Supplier: Digi-Key; link: http://www.precidip.com/AppHost/9696,1/Scripts/Modules/Catalog/Default.aspx?c=73&i=450&p=168&pdf=1&dsku=894-PP-NNN-10-001101; spicePre: H; BOM_Supplier Part: 894-70-012-10-001101-ND
CON4_1 CON4_5 CON4_6 = I2C: BOM_Manufacturer Part: BM04B-GHS-TBT(LF)(SN)(N); catid: 20; sourceId: i5d7pHZhZ; Description: CONN HEADER GH TOP 4POS 1.25MM; timeStamp: 1458998603; BOM_Supplier: Digi-Key; Link: http://www.jst-mfg.com/product/pdf/eng/eGH.pdf; spicePre: J; BOM_Supplier Part: 455-1580-2-ND
CON4_2 = CAN 1: BOM_Manufacturer Part: BM04B-GHS-TBT(LF)(SN)(N); catid: 20; sourceId: i5d7pHZhZ; Description: CONN HEADER GH TOP 4POS 1.25MM; timeStamp: 1458998603; BOM_Supplier: Digi-Key; Link: http://www.jst-mfg.com/product/pdf/eng/eGH.pdf; spicePre: J; BOM_Supplier Part: 455-1580-2-ND
CON4_3 = CAN 2: BOM_Manufacturer Part: BM04B-GHS-TBT(LF)(SN)(N); catid: 20; sourceId: i5d7pHZhZ; Description: CONN HEADER GH TOP 4POS 1.25MM; timeStamp: 1458998603; BOM_Supplier: Digi-Key; Link: http://www.jst-mfg.com/product/pdf/eng/eGH.pdf; spicePre: J; BOM_Supplier Part: 455-1580-2-ND
CON4_4 = CAN 3: BOM_Manufacturer Part: BM04B-GHS-TBT(LF)(SN)(N); catid: 20; sourceId: i5d7pHZhZ; Description: CONN HEADER GH TOP 4POS 1.25MM; timeStamp: 1458998603; BOM_Supplier: Digi-Key; Link: http://www.jst-mfg.com/product/pdf/eng/eGH.pdf; spicePre: J; BOM_Supplier Part: 455-1580-2-ND
CON6_1 = JTAG IO: BOM_Manufacturer Part: SM06B-SURS-TF(LF)(SN); catid: 20; sourceId: i5d7pHZhZ; Description: CONN HEADER SUR 6POS .8MM IDC; timeStamp: 1458998603; BOM_Supplier: Digi-Key; Link: http://www.jst-mfg.com/product/pdf/eng/eSUR.pdf; spicePre: J; BOM_Supplier Part: SM06B-SURS-TF(LF)(SN)-ND
CON6_2 = JTAG FMU: BOM_Manufacturer Part: SM06B-SURS-TF(LF)(SN); catid: 20; sourceId: i5d7pHZhZ; Description: CONN HEADER SUR 6POS .8MM IDC; timeStamp: 1458998603; BOM_Supplier: Digi-Key; Link: http://www.jst-mfg.com/product/pdf/eng/eSUR.pdf; spicePre: J; BOM_Supplier Part: SM06B-SURS-TF(LF)(SN)-ND
CON6_3 = TELEM 1: BOM_Manufacturer Part: BM06B-GHS-TBT(LF)(SN)(N); catid: 20; sourceId: i5d7pHZhZ; Description: CONN HEADER GH TOP 6POS 1.25MM; timeStamp: 1458998603; BOM_Supplier: Digi-Key; Link: http://www.jst-mfg.com/product/pdf/eng/eGH.pdf; spicePre: J; BOM_Supplier Part: 455-1582-2-ND
CON6_4 = TELEM 2: BOM_Manufacturer Part: BM06B-GHS-TBT(LF)(SN)(N); catid: 20; sourceId: i5d7pHZhZ; Description: CONN HEADER GH TOP 6POS 1.25MM; timeStamp: 1458998603; BOM_Supplier: Digi-Key; Link: http://www.jst-mfg.com/product/pdf/eng/eGH.pdf; spicePre: J; BOM_Supplier Part: 455-1582-2-ND
CON6_5 = GPS 1: BOM_Manufacturer Part: BM08B-GHS-TBT(LF)(SN)(N); catid: 20; sourceId: i5d7pHZhZ; Description: CONN HEADER GH TOP 8POS 1.25MM; timeStamp: 1458998603; BOM_Supplier: Digi-Key; Link: http://www.jst-mfg.com/product/pdf/eng/eGH.pdf; spicePre: J; BOM_Supplier Part: 455-1584-2-ND
CON6_6 = GPS 2: BOM_Manufacturer Part: BM06B-GHS-TBT(LF)(SN)(N); catid: 20; sourceId: i5d7pHZhZ; Description: CONN HEADER GH TOP 6POS 1.25MM; timeStamp: 1458998603; BOM_Supplier: Digi-Key; Link: http://www.jst-mfg.com/product/pdf/eng/eGH.pdf; spicePre: J; BOM_Supplier Part: 455-1582-2-ND
CON6_7 = MOTOR 1: BOM_Manufacturer Part: BM06B-GHS-TBT(LF)(SN)(N); catid: 20; sourceId: i5d7pHZhZ; Description: CONN HEADER GH TOP 6POS 1.25MM; timeStamp: 1458998603; BOM_Supplier: Digi-Key; Link: http://www.jst-mfg.com/product/pdf/eng/eGH.pdf; spicePre: J; BOM_Supplier Part: 455-1582-2-ND
CON6_8 = MOTOR 2: BOM_Manufacturer Part: BM06B-GHS-TBT(LF)(SN)(N); catid: 20; sourceId: i5d7pHZhZ; Description: CONN HEADER GH TOP 6POS 1.25MM; timeStamp: 1458998603; BOM_Supplier: Digi-Key; Link: http://www.jst-mfg.com/product/pdf/eng/eGH.pdf; spicePre: J; BOM_Supplier Part: 455-1582-2-ND
CON6_9 = MOTOR 3: BOM_Manufacturer Part: BM06B-GHS-TBT(LF)(SN)(N); catid: 20; sourceId: i5d7pHZhZ; Description: CONN HEADER GH TOP 6POS 1.25MM; timeStamp: 1458998603; BOM_Supplier: Digi-Key; Link: http://www.jst-mfg.com/product/pdf/eng/eGH.pdf; spicePre: J; BOM_Supplier Part: 455-1582-2-ND
CON6_10 = MOTOR 4: BOM_Manufacturer Part: BM06B-GHS-TBT(LF)(SN)(N); catid: 20; sourceId: i5d7pHZhZ; Description: CONN HEADER GH TOP 6POS 1.25MM; timeStamp: 1458998603; BOM_Supplier: Digi-Key; Link: http://www.jst-mfg.com/product/pdf/eng/eGH.pdf; spicePre: J; BOM_Supplier Part: 455-1582-2-ND
CON8_1 = GIMBAL: BOM_Manufacturer Part: BM08B-GHS-TBT(LF)(SN)(N); catid: 20; sourceId: i5d7pHZhZ; Description: CONN HEADER GH TOP 8POS 1.25MM; timeStamp: 1458998603; BOM_Supplier: Digi-Key; Link: http://www.jst-mfg.com/product/pdf/eng/eGH.pdf; spicePre: J; BOM_Supplier Part: 455-1584-2-ND
CON8_3 = MOTOR 1: BOM_Manufacturer Part: BM08B-GHS-TBT(LF)(SN)(N); sourceId: i5d7pHZhZ; Description: CONN HEADER GH TOP 8POS 1.25MM; timeStamp: 1458998603; BOM_Supplier Part: 455-1584-2-ND; BOM_Supplier: Digi-Key; Link: http://www.jst-mfg.com/product/pdf/eng/eGH.pdf; spicePre: J
CON8_4 = MOTOR 2: BOM_Manufacturer Part: BM08B-GHS-TBT(LF)(SN)(N); sourceId: i5d7pHZhZ; Description: CONN HEADER GH TOP 8POS 1.25MM; timeStamp: 1458998603; BOM_Supplier Part: 455-1584-2-ND; BOM_Supplier: Digi-Key; Link: http://www.jst-mfg.com/product/pdf/eng/eGH.pdf; spicePre: J
CON8_5 = MOTOR 3: BOM_Manufacturer Part: BM08B-GHS-TBT(LF)(SN)(N); sourceId: i5d7pHZhZ; Description: CONN HEADER GH TOP 8POS 1.25MM; timeStamp: 1458998603; BOM_Supplier Part: 455-1584-2-ND; BOM_Supplier: Digi-Key; Link: http://www.jst-mfg.com/product/pdf/eng/eGH.pdf; spicePre: J
CON8_6 = MOTOR 4: BOM_Manufacturer Part: BM08B-GHS-TBT(LF)(SN)(N); sourceId: i5d7pHZhZ; Description: CONN HEADER GH TOP 8POS 1.25MM; timeStamp: 1458998603; BOM_Supplier Part: 455-1584-2-ND; BOM_Supplier: Digi-Key; Link: http://www.jst-mfg.com/product/pdf/eng/eGH.pdf; spicePre: J
D1-D11 = DIODE: BOM_Manufacturer Part: PESD0402-140; Contributor: geekness; BOM_Supplier: Mouser; link: http://www.mouser.com/ds/2/240/Littelfuse_Polymer_ESD_Suppressor_PESD0402_140_Pro-1092713.pdf; spicePre: D; BOM_Supplier Part: 650-PESD0402-140
D12 = DIODE: BOM_Manufacturer Part: MSS1P4-M3/89A; Contributor: geekness; BOM_Supplier: Element14; spicePre: D; BOM_Supplier Part: 05W6894
DF17(1.0H)-80DP-0.5V(57) = PIXHAWK Cube: BOM_Manufacturer Part: DF17(1.0H)-80DP-0.5V(57); Contributor: geekness; BOM_Supplier: Mouser; link: http://www.mouser.com/ds/2/185/hirose%20electric_en_df17_20130411-550612.pdf; spicePre: U; BOM_Supplier Part: 798-DF1710H80DP05V57
IMX6 = Solo Link IMX6: Contributor: geekness; BOM_Mounted: No; BOM_Manufacturer Part: Solo Link IMX6; spicePre: I
PAD1-PAD4 PAD13-PAD16 = ESC Select: catid: 20; description: Solder Jumper; Contributor: SparkFun; sourceId: u4NHBvNHB; timeStamp: 1458998064; BOM_Manufacturer Part: ?; spicePre: S
PAD5 = MOTOR 1: Contributor: geekness; BOM_Manufacturer Part: Motor Pad; spicePre: M
PAD6 = MOTOR 2: Contributor: geekness; BOM_Manufacturer Part: Motor Pad; spicePre: M
PAD7 = MOTOR 3: Contributor: geekness; BOM_Manufacturer Part: Motor Pad; spicePre: M
PAD8 = MOTOR 4: Contributor: geekness; BOM_Manufacturer Part: Motor Pad; spicePre: M
PAD9 = MOTOR 5: Contributor: geekness; BOM_Manufacturer Part: Motor Pad; spicePre: M
PAD10 = MOTOR 6: Contributor: geekness; BOM_Manufacturer Part: Motor Pad; spicePre: M
PAD11 = MOTOR 7: Contributor: geekness; BOM_Manufacturer Part: Motor Pad; spicePre: M
PAD12 = MOTOR 8: Contributor: geekness; BOM_Manufacturer Part: Motor Pad; spicePre: M
PSM = Power Selection Module: Contributor: geekness; BOM_Mounted: No; BOM_Manufacturer Part: Power Selection Module; BOM_Supplier: ProfiCNC; link: http://www.proficnc.com/en/system-kits/84-power-selection-module.html; spicePre: P; BOM_Supplier Part: PSM_C
RF = Resistor: Contributor: geekness; BOM_Supplier: Digi-Key; link: https://www.digikey.com/product-detail/en/vishay-dale/CRCW040210K0FKED/541-10.0KLCT-ND/1183237; BOM_Manufacturer Part: ?; spicePre: R; BOM_Supplier Part: undefined
U1-U8 U11 U13 = FILTER: BOM_Manufacturer Part: NFM18PC104R1C3D; Contributor: geekness; BOM_Supplier: Digi-Key; link: https://media.digikey.com/pdf/Data%20Sheets/AVX%20PDFs/KNH16_Series.pdf; spicePre: U; BOM_Supplier Part: 490-6969-2-ND
U9 = ISL54220IRTZ: Contributor: geekness; BOM_Manufacturer Part: ISL54220IRTZ; BOM_Supplier: Mouser; link: https://www.intersil.com/content/dam/Intersil/documents/isl5/isl54220.pdf; spicePre: U; BOM_Supplier Part: 968-ISL54220IRTZ
U10 = USB: Contributor: geekness; BOM_Manufacturer Part: 10118194-0001LF; BOM_Supplier: Digi-Key; link: http://cdn.amphenol-icc.com/media/wysiwyg/files/documentation/datasheet/inputoutput/io_usb_micro.pdf; spicePre: U; BOM_Supplier Part: 609-4618-1-ND
U12 = ACS780KLRTR-150U-T: Contributor: geekness; BOM_Supplier: Digi-Key; link: http://cdn.amphenol-icc.com/media/wysiwyg/files/documentation/datasheet/inputoutput/io_usb_micro.pdf; Manufacturer: ACS780KLRTR-150U-T; BOM_Manufacturer Part: ?; spicePre: U; BOM_Supplier Part: 620-1822-1-ND